# EAGLE design w27-USBIO-v03(rev2_3) (EAGLE 6.6.0)
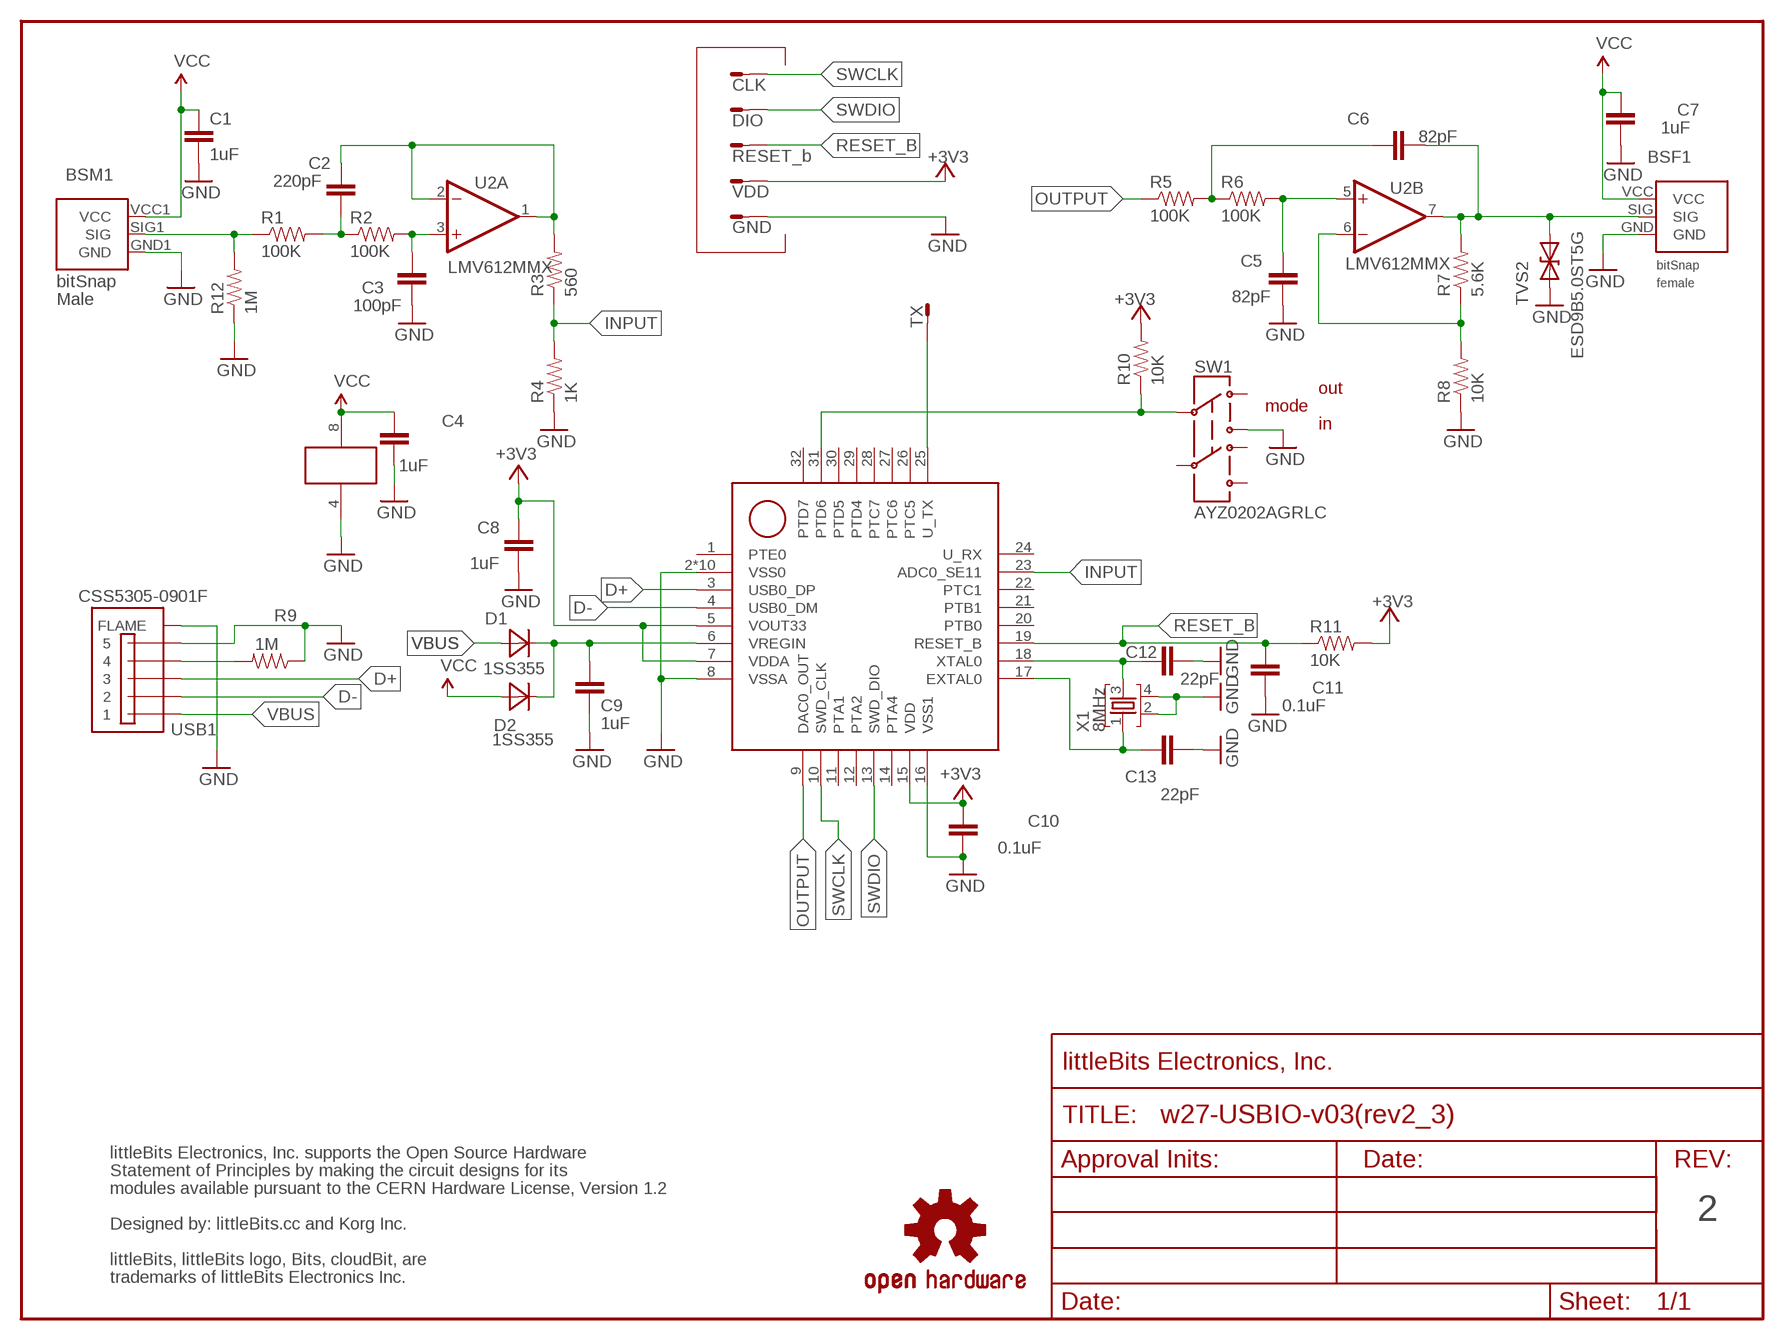
[diagram p0: schematic, sheet 1]

## Parts
BSF1  BITSNAP_V03_FEMALE  [BITSNAP_V03_FEMALE]
BSM1  BITSNAP_V03_MALE  [BITSNAP_V03_MALE]
C1  1uF  CC_1608_0.8_TBR_LB_1  [CC_1608_0.8_TBR_LB_1PRIMARY]
C2  220pF  CC_1608_0.8_TBR_LB_1  [CC_1608_0.8_TBR_LB_1PRIMARY]
C3  100pF  CC_1608_0.8_TBR_LB_1  [CC_1608_0.8_TBR_LB_1PRIMARY]
C4  1uF  CC_1608_0.8_TBR_LB_1  [CC_1608_0.8_TBR_LB_1PRIMARY]
C5  82pF  CC_1608_0.8_TBR_LB_1  [CC_1608_0.8_TBR_LB_1PRIMARY]
C6  82pF  CC_1608_0.8_TBR_LB_1  [CC_1608_0.8_TBR_LB_1PRIMARY]
C7  1uF  CC_1608_0.8_TBR_LB_1  [CC_1608_0.8_TBR_LB_1PRIMARY]
C8  1uF  CC_1608_0.8_TBR_LB_1  [CC_1608_0.8_TBR_LB_1PRIMARY]
C9  1uF  CC_1608_0.8_TBR_LB_1  [CC_1608_0.8_TBR_LB_1PRIMARY]
C10  0.1uF  CC_1608_0.8_TBR_LB_1  [CC_1608_0.8_TBR_LB_1PRIMARY]
C11  0.1uF  CC_1608_0.8_TBR_LB_1  [CC_1608_0.8_TBR_LB_1PRIMARY]
C12  22pF  CC_1608_0.8_TBR_LB_1  [CC_1608_0.8_TBR_LB_1PRIMARY]
C13  22pF  CC_1608_0.8_TBR_LB_1  [CC_1608_0.8_TBR_LB_1PRIMARY]
D1  1SS355  DISC_ROHM-UMD2_#_TBR_LB_1  [DISC_ROHM-UMD2_#_TBR_LB_1PRIMARY]
D2  1SS355  DISC_ROHM-UMD2_#_TBR_LB_1  [DISC_ROHM-UMD2_#_TBR_LB_1PRIMARY]
FRAME1  FRAME-LETTER-OHWOHW  [FABDWG01-OHW]
JP1  GND  TEST_POINT_1  [TEST_POINT_1PRIMARY]
JP2  VDD  TEST_POINT_1  [TEST_POINT_1PRIMARY]
JP3  RESET_b  TEST_POINT_1  [TEST_POINT_1PRIMARY]
JP4  DIO  TEST_POINT_1  [TEST_POINT_1PRIMARY]
JP5  CLK  TEST_POINT_1  [TEST_POINT_1PRIMARY]
JP6  TX  TEST_POINT_1  [TEST_POINT_1PRIMARY]
R1  100K  R_1608_LB  [R_1608_LB]
R2  100K  R_1608_LB  [R_1608_LB]
R3  560  R_1608_LB  [R_1608_LB]
R4  1K  R_1608_LB  [R_1608_LB]
R5  100K  R_1608_LB  [R_1608_LB]
R6  100K  R_1608_LB  [R_1608_LB]
R7  5.6K  R_1608_LB  [R_1608_LB]
R8  10K  R_1608_LB  [R_1608_LB]
R9  1M  R_1608_LB  [R_1608_LB]
R10  10K  R_1608_LB  [R_1608_LB]
R11  10K  R_1608_LB  [R_1608_LB]
R12  1M  RESISTOR0402  [RES-0402]
SW1  AYZ0202AGRLC  SW_MS-22C01_#_TBR_LB_1  [SW_MS-22C01_#_TBR_LB_1PRIMARY]
TVS2  ESD9B5.0ST5G  DIODE-TVSSOD-923  [SOD-923]
U1  MKL26Z64VFM4  IC_TI-QFN32_0.5_TBR_LB_1  [IC_TI-QFN32_0.5_TBR_LB_1PRIMARY]
U2  LMV612MMX  IC_TSSOP8-DCK_0.65_TBR_LB_1  [IC_TSSOP8-DCK_0.65_TBR_LB_1PRIMARY]
U$1  OSHWCREDIT-KORG  [OSHWCREDIT-KORG]
U$5  OSHW-LOGOL  [OSHW-LOGO-L]
USB1  CSS5305-0901F  CSS5305-0109F  [MICRO-USB-FRONT-DIP-REAR-SMD]
X1  8MHz  X_ROSON_RT5_#_TBR_LB_1  [X_ROSON_RT5_#_TBR_LB_1PRIMARY]

## Nets
+3V3: C8.2 C10.2 JP2.1(S) R10.2 R11.2 U1.5(VOUT33) U1.7(VDDA) U1.15(VDD)
D+: U1.3(USB0_DP) USB1.3
D-: U1.4(USB0_DM) USB1.2
GND: BSF1.GND BSM1.GND1(GND) C1.2 C3.1 C4.1 C5.1 C7.1 C8.1 C9.2 C10.1 C11.1 C12.1 C13.1 JP1.1(S) R4.1 R8.1 R9.1 R12.1 SW1.3 TVS2.1(A) U1.2(VSS0) U1.8(VSSA) U1.16(VSS1) U1.33(VSS0) U1.34(VSS0) U1.35(VSS0) U1.36(VSS0) U1.37(VSS0) U1.38(VSS0) U1.39(VSS0) U1.40(VSS0) U1.41(VSS0) U2.4(P:V-) USB1.5 USB1.6(FLAME) USB1.7(FLAME) USB1.8(FLAME) USB1.9(FLAME) USB1.10(FLAME) USB1.11(FLAME) X1.2 X1.4
INPUT: R3.1 R4.2 U1.23(ADC0_SE11)
N$1: BSM1.SIG1(SIG) R1.1 R12.2
N$2: C2.2 R3.2 U2.1(A:OUT) U2.2(A:-IN)
N$3: C3.2 R2.2 U2.3(A:+IN)
N$4: C2.1 R1.2 R2.1
N$5: R10.1 SW1.2 U1.31(PTD6)
N$6: BSF1.SIG C6.2 R7.2 TVS2.2(C) U2.7(B:OUT)
N$8: C9.1 D1.2 D2.2 U1.6(VREGIN)
N$9: C6.1 R5.2 R6.1
N$10: C5.2 R6.2 U2.5(B:+IN)
N$13: R9.2 USB1.4
N$15: C13.2 U1.17(EXTAL0) X1.1
N$16: C12.2 U1.18(XTAL0) X1.3
N$20: R7.1 R8.2 U2.6(B:-IN)
OUTPUT: R5.1 U1.9(DAC0_OUT)
RESET_B: C11.2 JP3.1(S) R11.1 U1.19(RESET_B)
SWCLK: JP5.1(S) U1.10(SWD_CLK)
SWDIO: JP4.1(S) U1.13(SWD_DIO)
TX: JP6.1(S) U1.25(U_TX)
VBUS: D1.1 USB1.1
VCC: BSF1.VCC BSM1.VCC1(VCC) C1.1 C4.2 C7.2 D2.1 U2.8(P:V+)
Unconnected: SW1.1 SW1.4 SW1.5 SW1.6 U1.1(PTE0) U1.11(PTA1) U1.12(PTA2) U1.14(PTA4) U1.20(PTB0) U1.21(PTB1) U1.22(PTC1) U1.24(U_RX) U1.26(PTC5) U1.27(PTC6) U1.28(PTC7) U1.29(PTD4) U1.30(PTD5) U1.32(PTD7)

## Notes on the sheet
- out
- mode
- in
- 2

## Library data of the parts
BSF1 = bitSnap:BITSNAP_V03_FEMALE
BSM1 = bitSnap:BITSNAP_V03_MALE
C1-C13 = LB_K:CC_1608_0.8_TBR_LB_1
D1 D2 = LB_K:DISC_ROHM-UMD2_#_TBR_LB_1
FRAME1 = LITTLEBITS:FRAME-LETTER-OHW
JP1-JP6 = LB_K:TEST_POINT_1
R1-R11 = LB_K:R_1608_LB
R12 = LITTLEBITS:RESISTOR
SW1 = LB_K:SW_MS-22C01_#_TBR_LB_1
TVS2 = LITTLEBITS:DIODE-TVS: Bidirectional Transient Voltage Suppression Diode: Device conducts in avalanche mode after reaching a part dependent voltage threshold. Used for limiting voltage spikes on ESD sensitive inputs and outputs.; IEC_ESD_PROT0: +/-18kV; LB_PN: ?; MPN: ESD9B5.0ST5G; V_CLAMP: ?; V_OPERATION: 5V
U1 = LB_K:IC_TI-QFN32_0.5_TBR_LB_1
U2 = LB_K:IC_TSSOP8-DCK_0.65_TBR_LB_1
U$1 = LITTLEBITS:OSHWCREDIT-KORG
U$5 = LITTLEBITS:OSHW-LOGO: Open Source Hardware Logo This logo indicates the piece of hardware it is found on incorporates a OSHW license and/or adheres to the definition of open source hardware found here: http://freedomdefined.org/OSHW
USB1 = LITTLEBITS:CSS5305-0109F
X1 = LB_K:X_ROSON_RT5_#_TBR_LB_1

## Net classes
0 default: clearance 0.205 mm

## Board
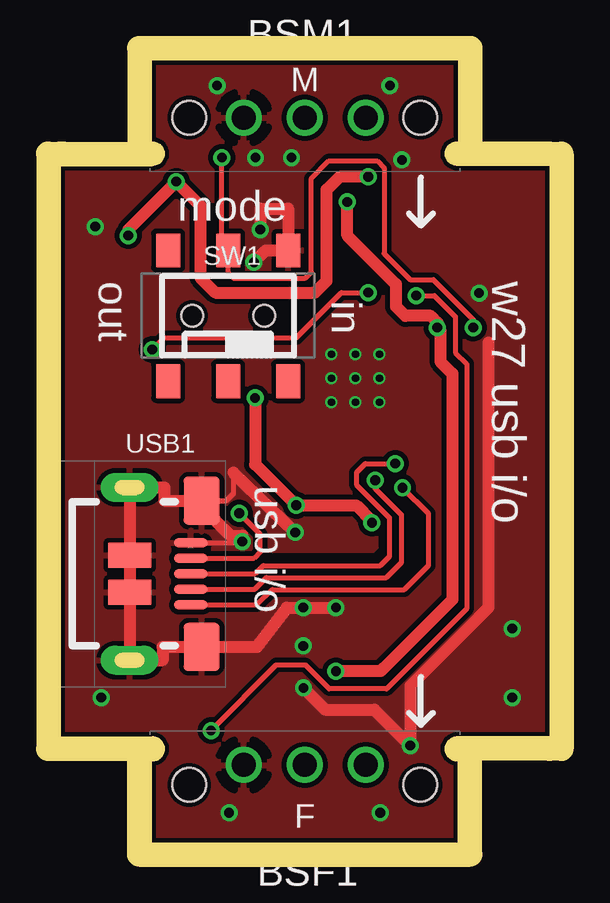
[diagram p1: board, top side]
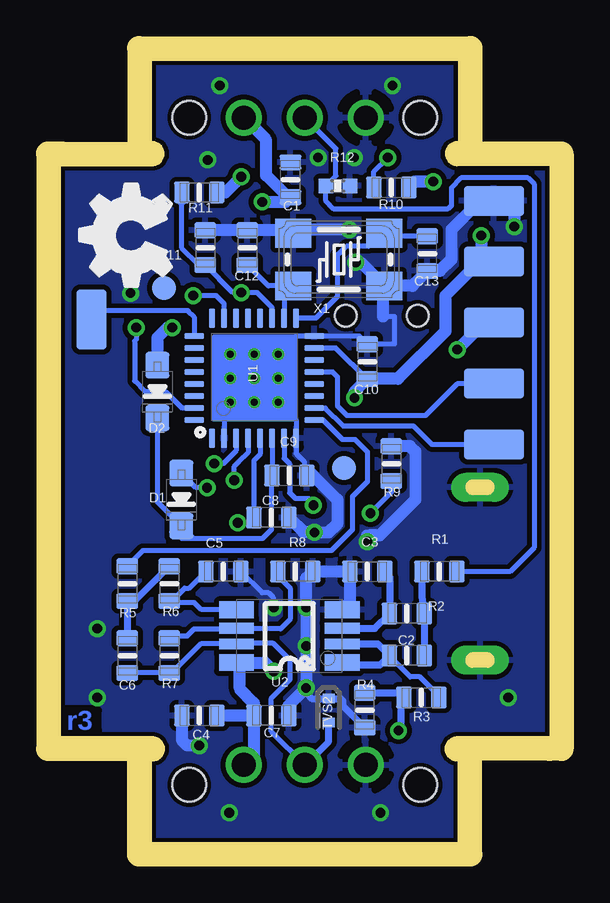
[diagram p2: board, bottom side, seen from below]

Size 20.4 x 32.6 mm. Coordinates in mm from the lower left corner, seen from the top.
Outline: 20.4,28.2 20.4,4.4
Outline: 0,28.2 0,4.4 3.85,4.4 arc-180 3.85,3.4 3.8,3.4 3.8,0 16.6,0 16.6,3.4 16.55,3.4 arc-180 16.55,4.4 20.4,4.4
Outline: 20.4,8.9 20.4,4.4
Copper layers (1*16): Top 0.035mm / dielectric 1.5mm / Bottom 0.035mm
Design rules "littleBitsDRC": minimum track width 0.2mm, minimum drill 0.2mm, track to track 0.2mm, track to pad 0.2mm, pad to pad 0.2mm, via to via 0.2mm, smd to smd 0mil, copper to edge 0.2mm, drill to drill 0.2mm, minimum pad ring 0.1mm, minimum via ring 0.15mm, stop-mask expansion 0.1mm, vias tented up to drill 0.5mm, thermal gap 0.2mm
tRestrict: 3 lines
Milling: 8 lines

### Footprints (pad centres in the part's own frame; a part is rotated, then mirrored left to right if it is on the bottom)
BITSNAP_V03_FEMALE = drill 1: GND 4.065,3.44; SIG 6.605,3.44; VCC 9.145,3.44 | hole 1.4: 1.785,2.61; 11.425,2.61
BITSNAP_V03_MALE = drill 1: GND1 9.145,2.61; SIG1 6.605,2.61; VCC1 4.065,2.61 | hole 1.4: 1.785,2.61; 11.425,2.61
CC_1608_0.8_TBR_LB_1PRIMARY = smd 0.65 x 0.9: 1 -0.725,0; 2 0.725,0
DISC_ROHM-UMD2_#_TBR_LB_1PRIMARY = smd 1.1 x 1: 1 -1.1,0; 2 1.1,0
TEST_POINT_1PRIMARY = smd 1.25 x 2.5: 1 0,0
R_1608_LB = smd 0.65 x 0.9: 1 -0.725,0; 2 0.725,0
RES-0402 = smd 0.6 x 0.6: 1 -0.5,0; 2 0.5,0
SW_MS-22C01_#_TBR_LB_1PRIMARY = smd 1.4 x 1: 1 2.725,2.5; 2 2.725,0; 3 2.725,-2.5; 4 -2.725,2.5; 5 -2.725,0; 6 -2.725,-2.5 | hole 0.9: 0,1.5; 0,-1.5
SOD-923 = smd 0.4 x 0.5: 1 -0.5,0; 2 0.5,0
IC_TI-QFN32_0.5_TBR_LB_1PRIMARY = smd 0.8 x 0.24: 1 -2.5,1.75; 2 -2.5,1.25; 3 -2.5,0.75; 4 -2.5,0.25; 5 -2.5,-0.25; 6 -2.5,-0.75; 7 -2.5,-1.25; 8 -2.5,-1.75; 17 2.5,-1.75; 18 2.5,-1.25; 19 2.5,-0.75; 20 2.5,-0.25; 21 2.5,0.25; 22 2.5,0.75; 23 2.5,1.25; 24 2.5,1.75 | smd 0.24 x 0.8: 9 -1.75,-2.5; 10 -1.25,-2.5; 11 -0.75,-2.5; 12 -0.25,-2.5; 13 0.25,-2.5; 14 0.75,-2.5; 15 1.25,-2.5; 16 1.75,-2.5; 25 1.75,2.5; 26 1.25,2.5; 27 0.75,2.5; 28 0.25,2.5; 29 -0.25,2.5; 30 -0.75,2.5; 31 -1.25,2.5; 32 -1.75,2.5 | drill 0.3 pad 0.5: 33 -1,1; 34 0,1; 35 1,1; 36 -1,0; 37 0,0; 38 1,0; 39 -1,-1; 40 0,-1; 41 1,-1 | smd 1 x 1: 42 -3.75,-3.75; 43 3.75,3.75
IC_TSSOP8-DCK_0.65_TBR_LB_1PRIMARY = smd 0.7 x 1.45: 1 -1.1,-2.2; 4 1.1,-2.2; 5 1.1,2.2; 8 -1.1,2.2 | smd 0.45 x 1.45: 2 -0.325,-2.2; 3 0.325,-2.2; 6 0.325,2.2; 7 -0.325,2.2
MICRO-USB-FRONT-DIP-REAR-SMD = smd 1.4 x 0.4: 1 5.45,-1.3; 2 5.45,-0.65; 3 5.45,0; 4 5.45,0.65; 5 5.45,1.3 | drill 0.6 pad 1.2 long: 6 2.9,-3.6; 7 2.9,3.6 | smd 1.5 x 2: 8 5.9,-3.05; 9 5.9,3.05 | smd 1.8 x 1.05: 10 2.9,-0.775; 11 2.9,0.775
X_ROSON_RT5_#_TBR_LB_1PRIMARY = smd 1.5 x 1.2: 1 -1.9,-1.1; 2 1.9,-1.1; 3 1.9,1.1; 4 -1.9,1.1

### Placement (x,y rotation side)
BSF1  3.6,-0.21 0 top
BSM1  16.8,32.81 180 top
C1  10.8,27.61 90 bottom
C2  5.95,7.79 180 bottom
C3  7.6,11.29 0 bottom
C4  14.6,5.29 0 bottom
C5  13.6,11.29 180 bottom
C6  17.59,7.79 270 bottom
C7  11.6,5.29 180 bottom
C8  11.6,13.54 180 bottom
C9  10.85,15.29 0 bottom
C10  7.6,20.04 270 bottom
C11  14.35,24.79 270 bottom
C12  12.6,24.79 270 bottom
C13  5.1,24.54 90 bottom
D1  15.35,14.29 270 bottom
D2  16.34,18.79 270 bottom
E$1  [OSHW_FILLX150_NOTEXT]  15.76,22.35 0 top
FRAME1  3.6,-0.21 0 top
JP1  2.33,26.74 270 bottom
JP2  2.33,24.2 270 bottom
JP3  2.33,21.66 270 bottom
JP4  2.33,19.12 270 bottom
JP5  2.33,16.58 90 bottom
JP6  19.09,21.79 180 bottom
R1  4.6,11.29 180 bottom
R2  5.95,9.54 180 bottom
R3  5.35,6.04 0 bottom
R4  7.7,5.51 90 bottom
R5  17.59,10.79 270 bottom
R6  15.85,10.79 270 bottom
R7  15.85,7.79 270 bottom
R8  10.6,11.29 180 bottom
R9  6.6,15.79 270 bottom
R10  6.6,27.29 0 bottom
R11  14.6,27.09 0 bottom
R12  8.83,27.36 180 bottom
SW1  7,21.94 90 top
TVS2  9.21,5.5 270 bottom
U1  12.31,19.35 90 bottom
U2  10.85,8.6 90 bottom
U$1  -73.27,-70.8 0 top  (outside the outline)
U$5  -23.71,-67.69 0 top  (outside the outline)
USB1  0,11.2 0 top
X1  8.78,24.29 180 bottom

### Tracks (layer width: path | path; a pad name or v marks a point on that pad's centre or on a via)
+3V3  (via drill 0.41 pad 0.6)
  Top 0.5: v2.85,25.29 2.85,25.54 v4.85,27.54 5.85,26.54 5.85,23.54 6.47,22.91 10.62,22.91 11.11,23.4 11.11,27.2 11.65,27.74 v12.85,27.74 | v13,13.32 13,13.39 12.34,14.05 v9.84,14.05 8.13,15.76 v8.13,18.52
  Bottom 0.2: U1.7 11.06,16 10.83,15.77 10.83,14.57 10.6,14.34 10.02,14.34 v9.84,14.05 | U1.5 12.06,16.18 12.32,15.91 C8.2 | C8.2 12.32,13.29 | U1.15 8.9,20.6 7.62,19.31 C10.2 | 2.85,24.72 3.19,24.72 3.19,24.2 | 5.62,27.54 5.87,27.54 R10.2 | C10.2 | U1.15 | v13,13.32 12.54,13.32 C8.2 | JP2.1
  Bottom 0.5: v4.85,27.54 5.62,27.54 5.6,27.52 | 3.19,24.2 3.19,23.95 4.35,22.79 4.35,21.29 6.32,19.31 C10.2 8.13,18.78 v8.13,18.52 | JP2.1 2.85,24.72 v2.85,25.29 | R11.2 13.5,27.09 v12.85,27.74
D+  (via drill 0.41 pad 0.6)
  Top 0.2: USB1.3 8.13,11.2 8.47,11.54 13.35,11.54 13.72,11.91 13.72,13.54 12.35,14.91 12.35,15.41 12.72,15.79 v13.97,15.79
  Bottom 0.2: v13.97,15.79 13.6,15.79 13.06,16.32 U1.3
D-  (via drill 0.41 pad 0.6)
  Top 0.2: USB1.2 8.11,10.55 8.6,11.04 13.6,11.04 14.22,11.66 14.22,13.66 13.13,14.75 v13.13,15.09
  Bottom 0.2: U1.4 12.56,16.25 12.97,15.84 13.13,15.67 v13.13,15.09
GND  (via drill 0.41 pad 0.6)
  Top 0.2: 7.22,15.41 7.22,14.54 6.93,14.25 USB1.9 | 7.6,12.79 7.3,12.5 USB1.5
  Top 0.5: v8.35,25.54 8.35,26.41 9.5,26.41 SW1.3 8.57,24.67 v8.08,24.18 | 7.22,15.41 v9.8,12.92 | 7.6,12.79 7.1,12.79 5.9,13.98 USB1.9 4.35,14.25 4.35,14.8 USB1.7 USB1.6 4.28,7.6 4.28,8.15 8.21,8.15 9.45,9.79 v10.14,9.79 v11.5,9.79 | 17.84,20.84 17.84,9.79 14.6,6.54 v14.6,4.04 13.1,5.54 11.04,5.54 v10.14,6.44
  Bottom 0.2: 6.95,21.91 6.47,21.91 6.47,20.77 C10.1 7.93,21.1 10.56,21.1 U1.41 | 9.9,15.35 10.22,15.66 10.22,15.86 10.56,16.2 10.56,17.6 U1.39 | U1.33 13.56,18.1 U1.2 | 13.56,19.35 13.56,20.6 13.31,20.85 | v11.5,9.79 11.5,10.19 11.71,10.4 11.98,10.4 C5.1 | U1.33 | U1.2
  Bottom 0.3: v10.14,6.44 10.14,6.24 9.91,6 TVS2.1 8.71,6 8.61,5.9 8.61,5.7 R4.1
  Bottom 0.406: 7.6,12.79 7.6,12.8 7.51,12.8
  Bottom 0.5: v1.47,25.66 1.47,26.74 2.9,26.74 4.1,25.54 4.1,24.29 4.57,23.81 C13.1 5.72,23.19 6.95,23.19 6.95,21.91 | v14.6,4.04 15.1,4.04 15.32,4.26 C4.1 | v7.6,12.54 7.6,12.79 7.1,12.79 5.6,14.29 5.6,16.29 5.82,16.52 R9.1 | 9.85,15.29 8.85,14.29 8.85,13.29 9.21,12.92 v9.8,12.92 10.25,12.92 C8.1 | 9.9,15.35 9.85,15.29 | 9.85,15.29 C9.2 | v8.35,25.54 10.85,25.54 10.87,25.52 C12.1 C11.1 | C7.1 10.87,5.71 v10.14,6.44 v10.14,6.45 v10.14,9.79 10.14,11.02 R8.1 C3.1 8.32,10.02 U2.4 | 7.21,12.8 7.51,12.8 7.61,12.8 | v11.5,9.79 | C5.1 12.87,11.16 | 7.66,4.75 R4.1 | v8.08,24.18 7.87,24.18 X1.4
  other vias: 17.46,22.89 1.72,6.04 10.14,8.19 18.84,8.91 18.84,6.04 14.25,28.44 8.14,28.54 9.64,28.54 13.75,31.54 6.54,31.54 13.35,1.24 7.04,1.24
  pour Top (no thermals): 10.76,20.85 10.76,17.85 13.76,17.85 13.76,20.85
  pour Bottom: 16.61,32.6 16.61,28.1 20.41,28.1 20.41,4.4 16.61,4.4 16.61,0.1 3.81,0.1 3.81,4.4 0.01,4.4 0.01,28.1 3.81,28.1 3.81,32.6
  pour Top: 16.61,32.6 16.61,28.1 20.41,28.1 20.4,4.4 16.61,4.4 16.6,0 3.8,0 3.81,4.4 0,4.4 0,28.2 3.81,28.1 3.8,32.6
INPUT  (via drill 0.41 pad 0.6)
  Top 0.2: v14.85,22.79 15.6,22.79 16.47,21.91 16.47,20.41 16.95,19.94 16.95,9.73 13.61,6.4 11.21,6.4 10.21,7.4 9.01,7.4 6.29,4.68 v6.29,4.67
  Bottom 0.2: U1.23 | U1.23 13.56,22.45 13.9,22.79 v14.85,22.79 | 6.2,6.17 R3.1 6.2,6.04 6.2,6.09 6.2,6.17
  Bottom 0.3: 6.2,6.09 6.2,4.76 v6.29,4.67 | R4.2 6.27,6.24 R3.1
N$1
  Bottom 0.2: R1.1 1.65,11.29 0.65,12.29 0.65,27.44 0.9,27.69 3.7,27.69 4.1,27.29 4.1,26.54 4.25,26.39 8.98,26.39 9.33,26.73 R12.2 | BSM1.SIG1 8.91,28.91 8.91,27.77 R12.2 | 9.51,27.5 R12.2
N$2
  Bottom 0.2: R3.2 4.71,6.13 4.71,6.2 5.41,6.9 5.81,6.9 6.67,7.76 C2.2
  Bottom 0.3: U2.1 8.61,7.46 8.61,7.4 7.06,7.4 C2.2 7.16,8.27 U2.2 | R3.2
N$3
  Bottom 0.3: U2.3 7.29,8.92 R2.2 6.67,11.09 C3.2
N$4
  Bottom 0.3: R1.2 5.32,10.24 R2.1 C2.1
N$5  (via drill 0.41 pad 0.6)
  Top 0.2: SW1.2 7,23.73 7.22,23.52 10.22,23.52 10.47,23.77 10.47,27.66 11.21,28.4 13.21,28.4 13.51,28.1 13.51,24.54 14.59,23.45 15.56,23.45 17.22,21.79 v17.22,21.45 | SW1.2 7,25.01 7.35,25.01 7.03,24.7 6.71,24.7 6.75,24.73 v6.75,28.54 | SW1.2 6.95,24.72
  Bottom 0.2: U1.31 15.31,18.1 16,18.79 16.84,18.79 17.29,19.24 17.29,20.89 17.22,20.96 v17.22,21.45 | R10.1 7.32,27.96 v6.75,28.54 | U1.31
N$6
  Bottom 0.2: BSF1.SIG 11.6,4.62 11.6,6.01 10.81,6.8 10.81,7.6 11.51,8.3 13.02,8.3 U2.7 13.07,8.3 14.51,8.3 15.75,7.07 R7.2 C6.2
  Bottom 0.3: BSF1.SIG 10.18,3.23 9.21,4.2 TVS2.2
N$8
  Bottom 0.2: 11.6,15.26 11.6,13.04 11.97,12.66 14.82,12.66 | C9.1 11.6,15.26 | C9.1 U1.6 | D2.2 16.34,14.19 14.82,12.66 | 15.75,12.94 15.67,12.86 15.67,13.19 D1.2 15.35,12.66 14.82,12.66 | C9.1 11.6,15.29 11.6,15.26
N$9
  Bottom 0.2: R6.1 | R5.2
  Bottom 0.3: 16.14,11.51 R6.1 17.29,10.06 R5.2 C6.1
N$10
  Bottom 0.2: C5.2 15.01,10.6 15.21,10.6 15.77,10.04 15.85,10.04 R6.2 15.78,10 14.81,10 14.51,9.7 U2.5
N$13  (via drill 0.41 pad 0.6)
  Top 0.2: USB1.4 8.09,11.85 8.35,12.11 8.35,12.84 v7.46,13.72
  Bottom 0.2: v7.46,13.72 6.6,14.59 R9.2
N$15
  Bottom 0.2: U1.17 9.73,21.85 8.85,22.74 8.85,24.46 8.47,24.84 7.54,24.84 7,25.39 6.95,25.39 | 6.95,25.39 6.82,25.27 C13.2 | 6.95,25.39 6.89,25.39 X1.1 | U1.17
N$16
  Bottom 0.2: C12.2 11.72,23.19 10.75,23.19 | 10.75,23.19 11.06,22.88 U1.18 | X1.3 10.75,23.19 | 10.75,23.19 | U1.18
N$20
  Bottom 0.2: R7.1 15.75,8.61 15.1,8.61 14.81,8.9 13.07,8.9 U2.6 13.02,8.9 11.21,8.9 10.81,9.3 10.81,10.6 11.32,11.11 R8.2
OUTPUT
  Bottom 0.2: U1.9 9.43,17.6 8.62,16.79 8.1,16.79 7.6,16.29 7.6,15.04 8.22,14.41 8.22,13.04 9.1,12.16 16.95,12.16 17.51,11.6 | 17.51,11.6 R5.1 17.51,11.51 17.51,11.6 | U1.9
RESET_B  (via drill 0.41 pad 0.6)
  Top 0.2: v3.85,20.54 4.35,21.04 9.85,21.04 11.72,22.91 v12.85,22.91
  Bottom 0.2: JP3.1 2.73,21.66 | 14.25,24.06 C11.2 | 15.35,26.79 15.35,24.79 14.62,24.06 C11.2 | U1.19 | JP3.1 | C11.2 13.2,22.91 v12.85,22.91 12.19,22.91 11.56,22.29 U1.19
  Bottom 0.5: 2.73,21.66 v3.85,20.54 | 15.35,26.79 15.35,27.06 R11.1
SWCLK
  Bottom 0.2: U1.10 9.38,18.1 9.35,18.1 8.61,17.36 5.68,17.36 5.5,17.18 4.88,16.58 JP5.1 | U1.10 | JP5.1
SWDIO
  Bottom 0.2: U1.13 9.03,19.6 8.85,19.41 8.85,18.19 8.46,17.8 5.17,17.8 3.85,19.12 JP4.1 | U1.13 | JP4.1
TX
  Bottom 0.2: JP6.1 18.72,22.16 15.07,22.16 14.81,21.9 U1.25 | JP6.1 | U1.25
VBUS  (via drill 0.41 pad 0.6)
  Top 0.2: USB1.1 8.21,9.9 8.85,10.54 14.35,10.54 15.35,11.54 15.35,13.71 v14.27,14.78
  Bottom 0.2: D1.1 | v14.27,14.78 14.74,14.78 D1.1
VCC  (via drill 0.41 pad 0.6)
  Top 0.2: 13.36,7.14 13.46,7.14 13.46,7.24
  Top 0.5: v11.97,26.69 11.97,25.29 14,23.27 14,22.34 14.4,21.94 15.45,21.94 15.72,21.66 v15.72,21.45 15.85,21.33 15.85,20.04 16.34,19.54 16.34,10.12 13.46,7.24 13.36,7.14 v11.5,7.14
  Bottom 0.2: U2.8 13.46,7.5 13.46,7.24 13.55,7.24 13.55,7.33 | C4.2 13.78,5.29 | 13.78,5.29 | C7.2
  Bottom 0.5: D2.1 16.34,21.04 15.93,21.45 v15.72,21.45 | D2.1 | C7.2 13.78,5.29 C4.2 | BSF1.VCC 12.32,3.65 C7.2 | C7.2 12.32,5.81 12.91,6.4 12.91,7.37 U2.8 11.86,7.5 v11.5,7.14 | 12.71,30.18 BSM1.VCC1 11.81,29.27 11.81,27.8 10.9,26.89 C1.1 11,26.69 v11.97,26.69

### Text on the board
Bottom: r3
tPlace: mode | out | w27 usb i/o | in | usb i/o
tNames: BSM1 | BSF1
Measures: (x2) | (x2)
dxf: 3 | USB Audio Input-Output Module